# EasyEDA Pro project ProPrj.epro

# Schematic 模拟检测系统_2
Assembly Variant: Basic; Board Name: Board1; Create Date: 2026-07-22; Page Name: P1; Project Name: 院赛; Schematic Name: Schematic1; Update Date: 2026-07-22; Company: 嘉立创EDA; Page Size: A4; Version: V1.0
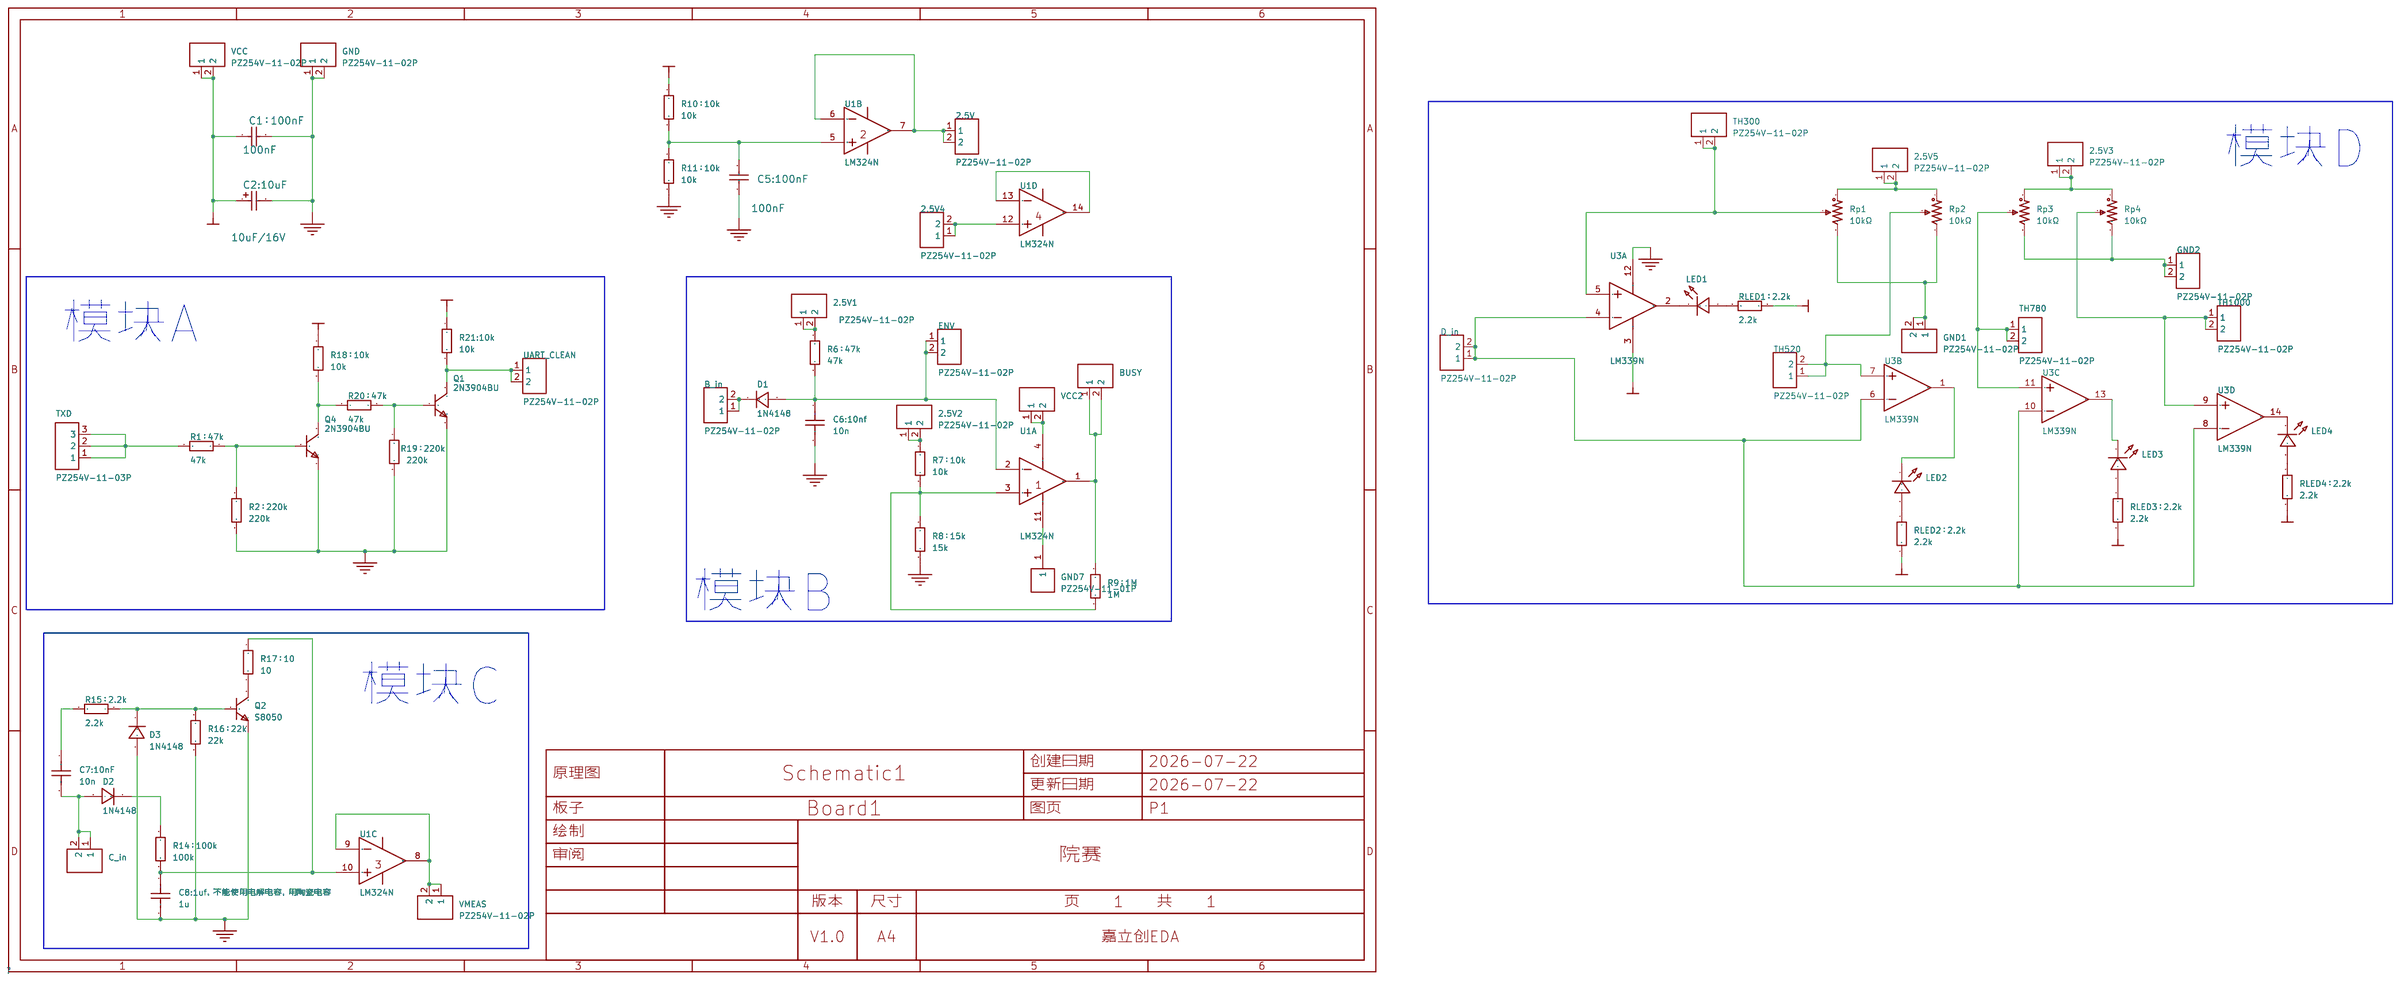
[diagram p0: schematic sheet]

## Parts
2.5V  PZ254V-11-02P  [HDR-TH_2P-P2.54-V-M]
2.5V1  PZ254V-11-02P  [HDR-TH_2P-P2.54-V-M]
2.5V2  PZ254V-11-02P  [HDR-TH_2P-P2.54-V-M]
2.5V3  PZ254V-11-02P  [HDR-TH_2P-P2.54-V-M]
2.5V4  PZ254V-11-02P  [HDR-TH_2P-P2.54-V-M]
2.5V5  PZ254V-11-02P  [HDR-TH_2P-P2.54-V-M]
B_in  PZ254V-11-02P  [HDR-TH_2P-P2.54-V-M]
BUSY  PZ254V-11-02P  [HDR-TH_2P-P2.54-V-M]
C1：100nF  100nF  [CAP-TH_L8.5-W5.0-P5.00-D1.2]
C2:10uF  10uF/16V  [CAP-TH_L8.5-W5.0-P5.00-D1.2]
C5:100nF  100nF  [CAP-TH_L8.5-W5.0-P5.00-D1.2]
C6:10nf  10n  [CAP-TH_L8.5-W5.0-P5.00-D1.2]
C7:10nF  10n  [CAP-TH_L8.5-W5.0-P5.00-D1.2]
C8:1uf，不能使用电解电容，用陶瓷电容  1u  [CAP-TH_L8.5-W5.0-P5.00-D1.2]
C_in  PZ254V-11-02P  [HDR-TH_2P-P2.54-V-M]
D1  1N4148  [DO-35_BD2.0-L4.2-P8.20-D0.5-RD]
D2  1N4148  [DO-35_BD2.0-L4.2-P8.20-D0.5-RD]
D3  1N4148  [DO-35_BD2.0-L4.2-P8.20-D0.5-RD]
D_in  PZ254V-11-02P  [HDR-TH_2P-P2.54-V-M]
ENV  PZ254V-11-02P  [HDR-TH_2P-P2.54-V-M]
GND  PZ254V-11-02P  [HDR-TH_2P-P2.54-V-M]
GND1  PZ254V-11-02P  [HDR-TH_2P-P2.54-V-M]
GND2  PZ254V-11-02P  [HDR-TH_2P-P2.54-V-M]
GND7  PZ254V-11-01P  [HDR-TH_1P-P2.54-V-M]
LED1  WP1533BQ/ID  [LED-TH_BD5.8-P2.54-FD_BIUE]
LED2  WP1533BQ/ID  [LED-TH_BD5.8-P2.54-FD_BIUE]
LED3  WP1533BQ/ID  [LED-TH_BD5.8-P2.54-FD_BIUE]
LED4  WP1533BQ/ID  [LED-TH_BD5.8-P2.54-FD_BIUE]
Q1  2N3904BU  [TO-92-3_L5.1-W4.1-P1.27-L]
Q2  S8050  [TO-92-3_L5.1-W4.1-P1.27-L]
Q4  2N3904BU  [TO-92-3_L5.1-W4.1-P1.27-L]
R1：47k  47k  [R_AXIAL-0.3]
R2：220k  220k  [R_AXIAL-0.3]
R6：47k  47k  [R_AXIAL-0.3]
R7：10k  10k  [R_AXIAL-0.3]
R8：15k  15k  [R_AXIAL-0.3]
R9：1M  1M  [R_AXIAL-0.3]
R10：10k  10k  [R_AXIAL-0.3]
R11：10k  10k  [R_AXIAL-0.3]
R14：100k  100k  [R_AXIAL-0.3]
R15：2.2k  2.2k  [R_AXIAL-0.3]
R16：22k  22k  [R_AXIAL-0.3]
R17：10  10  [R_AXIAL-0.3]
R18：10k  10k  [R_AXIAL-0.3]
R19：220k  220k  [R_AXIAL-0.3]
R20：47k  47k  [R_AXIAL-0.3]
R21:10k  10k  [R_AXIAL-0.3]
RLED1：2.2k  2.2k  [R_AXIAL-0.3]
RLED2：2.2k  2.2k  [R_AXIAL-0.3]
RLED3：2.2k  2.2k  [R_AXIAL-0.3]
RLED4：2.2k  2.2k  [R_AXIAL-0.3]
Rp1  10kΩ  [RES-ADJ-TH_3296W-1-104_C48601076]
Rp2  10kΩ  [RES-ADJ-TH_3296W-1-104_C48601076]
Rp3  10kΩ  [RES-ADJ-TH_3296W-1-104_C48601076]
Rp4  10kΩ  [RES-ADJ-TH_3296W-1-104_C48601076]
TH300  PZ254V-11-02P  [HDR-TH_2P-P2.54-V-M]
TH520  PZ254V-11-02P  [HDR-TH_2P-P2.54-V-M]
TH780  PZ254V-11-02P  [HDR-TH_2P-P2.54-V-M]
TH1000  PZ254V-11-02P  [HDR-TH_2P-P2.54-V-M]
TXD  PZ254V-11-03P  [HDR-TH_3P-P2.54-V-M_PZ254V-11-03P]
U1  LM324N  [DIP-14_L19.4-W6.4-P2.54-LS7.6-BL]  (sections 1,2,3,4)
U3  LM339N  [PDIP-14_L19.3-W6.4-P2.54-LS9.0-BL]  (sections 1,2,3,4)
UART_CLEAN  PZ254V-11-02P  [HDR-TH_2P-P2.54-V-M]
VCC  PZ254V-11-02P  [HDR-TH_2P-P2.54-V-M]
VCC2  PZ254V-11-02P  [HDR-TH_2P-P2.54-V-M]
VMEAS  PZ254V-11-02P  [HDR-TH_2P-P2.54-V-M]

## Library data of the parts
2.5V 2.5V1-2.5V5 B_in BUSY C_in D_in ENV GND GND1 GND2 TH300 TH520 TH780 TH1000 UART_CLEAN VCC VCC2 VMEAS = PZ254V-11-02P: 插针结构:1x2P;间距:2.54mm;行距:-;圆针/方针:方针;安装方式:直插;排数:单排;总PIN位数:2P;额定电流:3A;额定电压:250V;配合针长度:6mm;塑高:2.5mm;端接针长度:3mm;触头材质:黄铜;触头镀层:-;工作温度:-40℃~+105℃;颜色:黑色;; LCSC Part Name: 1x2P 间距:2.54mm 方针 直插; Supplier Part: C492401; Manufacturer: XFCN(兴飞); Supplier Footprint: 插件,P=2.54mm; JLCPCB Part Class: Extended Part; Datasheet: https://item.szlcsc.com/datasheet/PZ254V-11-02P/502957.html; Supplier: LCSC; Pin Structure: 1x2P; Pitch: 2.54mm; Circluar Pins/Square Pins: 方针; Mounting Type: 直插; Number of Rows: 单排; Number of Pins: 2P; Current Rating: 3A; Voltage Rating (Max): 250V; Length of Mating Pin: 6mm; Insulation Height: 2.5mm; Length of End Connection Pin: 3mm; Contact Material: 黄铜; Operating Temperature: -40℃~+105℃; Color: 黑色
C1：100nF C5:100nF = Cap_1: Capacitor; Published: 8-Jun-2000; LatestRevisionDate: 17-Jul-2002; LatestRevisionNote: Re-released for DXP Platform.; Publisher: Altium Limited; DesignItemID: Cap; LibraryName: *
C2:10uF = Cap Pol1: Polarized Capacitor (Radial); Published: 8-Jun-2000; LatestRevisionDate: 17-Jul-2002; LatestRevisionNote: Re-released for DXP Platform.; Publisher: Altium Limited; LibraryName: Miscellaneous Devices
C6:10nf C7:10nF C8:1uf，不能使用电解电容，用陶瓷电容 = CT4-0805B104K500F3: 容值:100nF;精度:±10%;额定电压:50V;温度系数:X7R;; LCSC Part Name: 100nF ±10% 50V C3型（直脚）; Supplier Part: C84772; Manufacturer: FH(风华); Supplier Footprint: 插件,P=5.08mm; JLCPCB Part Class: 扩展库; Datasheet: https://atta.szlcsc.com/upload/public/pdf/source/20190402/C385200_059806A6312B28FF1421A2413EB641E1.pdf; Supplier: LCSC; Tolerance: ±10%; Voltage Rated: 50V; Temperature Coefficient: X7R
D1-D3 = 1N4148_C402212: 二极管配置:-;正向压降(Vf):1V@10mA;直流反向耐压(Vr):75V;整流电流:150mA;反向恢复时间(Trr):4ns;; LCSC Part Name: 75V 150mA; Supplier Part: C402212; Manufacturer: LGE(鲁光); Supplier Footprint: DO-35; JLCPCB Part Class: Extended Part; Datasheet: https://item.szlcsc.com/datasheet/1N4148/387357.html; Supplier: LCSC; Voltage - Forward(Vf@If): 1V@10mA; Voltage - DC Reverse(Vr): 75V; Current - Rectified: 150mA; Pd - Power Dissipation: 500mW; Reverse Leakage Current (Ir): 5uA@75V; Reverse Recovery Time (trr): 4ns; Non-Repetitive Peak Forward Surge Current: 2A
GND7 = PZ254V-11-01P: 插针结构:1x1P;间距:2.54mm;行距:-;圆针/方针:方针;安装方式:直插;排数:单排;总PIN位数:1P;额定电流:3A;额定电压:250V;配合针长度:6mm;塑高:2.5mm;端接针长度:3mm;触头材质:黄铜;触头镀层:-;工作温度:-40℃~+105℃;颜色:黑色;; LCSC Part Name: 1x1P 间距:2.54mm 方针 直插; Supplier Part: C492400; Manufacturer: XFCN(兴飞); Supplier Footprint: 插件,P=2.54mm; JLCPCB Part Class: Extended Part; Datasheet: https://item.szlcsc.com/datasheet/PZ254V-11-01P/502956.html; Supplier: LCSC; Pin Structure: 1x1P; Pitch: 2.54mm; Circluar Pins/Square Pins: 方针; Mounting Type: 直插; Number of Rows: 单排; Number of Pins: 1P; Current Rating: 3A; Voltage Rating (Max): 250V; Length of Mating Pin: 6mm; Insulation Height: 2.5mm; Length of End Connection Pin: 3mm; Contact Material: 黄铜; Operating Temperature: -40℃~+105℃; Color: 黑色
LED1-LED4 = WP1533BQ/ID: Supplier Part: C5213793; Manufacturer: Kingbright; Supplier Footprint: LED-TH; JLCPCB Part Class: Extended Part; Datasheet: https://item.szlcsc.com/datasheet/WP1533BQ%252FID/5909275.html; Supplier: LCSC
Q1 Q4 = 2N3904BU: 晶体管类型:NPN;集电极电流(Ic):200mA;集射极击穿电压(Vceo):40V;耗散功率(Pd):625mW;直流电流增益(hFE):100@10mA,1V;; LCSC Part Name: NPN 电流:200mA 电压:40V; Supplier Part: C124482; Manufacturer: onsemi(安森美); Supplier Footprint: TO-92; JLCPCB Part Class: Extended Part; Datasheet: https://item.szlcsc.com/datasheet/2N3904BU/125757.html; Supplier: LCSC; type: NPN; Current - Collector(Ic): 200mA; Collector - Emitter Voltage VCEO: 40V; Pd - Power Dissipation: 625mW; DC Current Gain: 100@10mA,1V; Transition frequency(fT): 300MHz; Current - Collector Cutoff: 50nA; Vce Saturation(VCE(sat)): 200mV; Operating Temperature: -55℃~+150℃; Emitter-Base Voltage(Vebo): 6V; Number: 1个NPN
Q2 = S8050_C20069125: 晶体管类型:NPN;集电极电流(Ic):500mA;集射极击穿电压(Vceo):25V;耗散功率(Pd):300mW;直流电流增益(hFE):120@50mA,1.0V;; LCSC Part Name: hFE:200-350，丝印:J3Y NPN 500mA 25V; Supplier Part: C20069125; Manufacturer: R+O(宏嘉诚); Supplier Footprint: SOT-23; JLCPCB Part Class: Extended Part; Datasheet: https://item.szlcsc.com/datasheet/S8050/21397163.html; Supplier: LCSC; type: NPN; Current - Collector(Ic): 500mA; Collector - Emitter Voltage VCEO: 25V; Pd - Power Dissipation: 300mW; DC Current Gain: 120@50mA,1.0V; Transition frequency(fT): 100MHz; Current - Collector Cutoff: 100nA; Vce Saturation(VCE(sat)): 600mV@500mA,50mA; Operating Temperature: -55℃~+150℃; Emitter-Base Voltage(Vebo): 5V
R1：47k R2：220k R6：47k R7：10k R8：15k R9：1M R10：10k R11：10k R14：100k R15：2.2k R16：22k R17：10 R18：10k R19：220k R20：47k R21:10k RLED1：2.2k RLED2：2.2k RLED3：2.2k RLED4：2.2k = Res_0603: Supplier Footprint: 0603
Rp1-Rp4 = 3296W-1-103: 阻值:10kΩ;精度:±10%;; LCSC Part Name: 10kΩ ±10%; Supplier Part: C118954; Manufacturer: BOCHEN(博晨); Supplier Footprint: 插件; JLCPCB Part Class: 扩展库; Datasheet: https://atta.szlcsc.com/upload/public/pdf/source/20171114/C118954_15106326646611117443.pdf; Supplier: LCSC; Tolerance: ±10%
TXD = PZ254V-11-03P: 插针结构:1x3P;间距:2.54mm;行距:-;圆针/方针:方针;安装方式:直插;排数:单排;总PIN位数:3P;额定电流:3A;额定电压:250V;配合针长度:6mm;塑高:2.5mm;端接针长度:3mm;工作温度:-40℃~+105℃;颜色:黑色;; LCSC Part Name: 1x3P 间距:2.54mm 方针 直插; Supplier Part: C2937625; Manufacturer: XFCN(兴飞); Supplier Footprint: 插件,P=2.54mm; JLCPCB Part Class: Extended Part; Datasheet: https://item.szlcsc.com/datasheet/PZ254V-11-03P/3293280.html; Supplier: LCSC; Pin Structure: 1x3P; Pitch: 2.54mm; Circluar Pins/Square Pins: 方针; Mounting Type: 直插; Number of Rows: 单排; Number of Pins: 3P; Current Rating: 3A; Voltage Rating (Max): 250V; Length of Mating Pin: 6mm; Insulation Height: 2.5mm; Length of End Connection Pin: 3mm; Operating Temperature: -40℃~+105℃; Color: 黑色
U1 = LM324N_C725320: 放大器数:4;轨到轨:-;增益带宽积(GBW):-;输入失调电压(Vos):9mV;压摆率(SR):-;输入偏置电流(Ib):250nA;; LCSC Part Name: 四路运算放大器; Supplier Part: C725320; Manufacturer: HGSEMI(华冠); Supplier Footprint: DIP-14; JLCPCB Part Class: Extended Part; Datasheet: https://item.szlcsc.com/datasheet/LM324N/771554.html; Supplier: LCSC; Number of Channels: 4; Maximum Power Supply Range (Vdd-Vss): 30V; Vos - Input Offset Voltage: 9mV; Input Offset Voltage Drift(Vos TC): 7uV/℃; Ib - Input Bias Current: 250nA; Input Offset Current(Ios): 50nA; Common Mode Rejection Ratio(CMRR): 80dB; Quiescent Current: 600uA; Output Current: 35mA; Operating Temperature: -40℃~+85℃; Single supply: 1.5V~30V; Dual Supply: -16V~-1.5V；1.5V~16V
U3 = LM339N_C39202084: 输入失调电压(Vos):5mV;输入偏置电流(Ib):25nA;; LCSC Part Name: 四差分比较器; Supplier Part: C39202084; Manufacturer: TI(德州仪器); Supplier Footprint: DIP-14; JLCPCB Part Class: Extended Part; Datasheet: https://www.ti.com/lit/gpn/lm339; Supplier: LCSC; Vos - Input Offset Voltage: 5mV; Ib - Input Bias Current: 25nA; Propagation Delay Time: 300ns; Quiescent Current: 2mA; Operating Temperature: -40℃~+85℃

## Nets
GND: C1：100nF.2 C2:10uF.2 C5:100nF.1 C6:10nf.2 C8:1uf，不能使用电解电容，用陶瓷电容.2 D3.2(A) GND.1 GND.2 Q1.1(E) Q2.2(E) Q4.1(E) R2：220k.2 R8：15k.2 R11：10k.2 R16：22k.2 R19：220k.2 U3.12(GND)
VCC: C1：100nF.1 C2:10uF.1 R10：10k.1 R18：10k.1 R21:10k.1 RLED1：2.2k.1 RLED2：2.2k.2 RLED3：2.2k.2 RLED4：2.2k.2 U3.3(V+) VCC.1 VCC.2
$1N7: R1：47k.2 TXD.1 TXD.2 TXD.3
$1N8: Q4.2(B) R1：47k.1 R2：220k.1
$1N40: C6:10nf.1 D1.2(A) ENV.1 ENV.2 R6：47k.2 U1.2(IN1-)
$1N42: GND7.1 U1.11(GND)
$1N48: C5:100nF.2 R10：10k.2 R11：10k.1 U1.5(IN2+)
$1N53: R7：10k.2 R8：15k.1 R9：1M.1 U1.3(IN1+)
$1N55: 2.5V.1 2.5V.2 U1.6(IN2-) U1.7(OUT2)
$1N76: C8:1uf，不能使用电解电容，用陶瓷电容.1 R14：100k.2 R17：10.1 U1.10(IN3+)
$1N77: C7:10nF.1 R15：2.2k.2
$1N78: D3.1(C) Q2.1(B) R15：2.2k.1 R16：22k.1
$1N81: Q2.3(C) R17：10.2
$1N84: D2.1(C) R14：100k.1
$1N96: Rp1.2 TH300.1 TH300.2 U3.5(IN+)
$1N111: LED2.2(A) RLED2：2.2k.1
$1N113: LED3.2(A) RLED3：2.2k.1
$1N116: Rp4.2 TH1000.1 TH1000.2 U3.9(IN+)
$1N118: GND1.1 GND1.2 Rp1.3 Rp2.3
$1N121: GND2.1 GND2.2 Rp3.3 Rp4.3
$1N124: LED4.2(A) RLED4：2.2k.1
$1N134: B_in.1 B_in.2 D1.1(C)
$1N135: C7:10nF.2 C_in.1 C_in.2 D2.2(A)
$1N136: BUSY.1 BUSY.2 R9：1M.2 U1.1(OUT1)
$1N139: U1.8(OUT3) U1.9(IN3-) VMEAS.1 VMEAS.2
$1N145: 2.5V1.1 2.5V1.2 R6：47k.1
$1N147: 2.5V2.1 2.5V2.2 R7：10k.1
$1N149: Q4.3(C) R18：10k.2 R20：47k.1
$1N151: Q1.2(B) R19：220k.1 R20：47k.2
$1N153: Q1.3(C) R21:10k.2 UART_CLEAN.1 UART_CLEAN.2
$1N160: D_in.1 D_in.2 U3.4(IN-) U3.6(IN-) U3.8(IN-) U3.10(IN-)
$1N162: LED1.2(A) RLED1：2.2k.2
$1N163: LED1.1(C) U3.2(OUT)
$1N169: Rp3.2 TH780.1 TH780.2 U3.11(IN+)
$1N170: Rp2.2 TH520.1 TH520.2 U3.7(IN+)
$1N175: LED2.1(C) U3.1(OUT)
$1N176: LED3.1(C) U3.13(OUT)
$1N177: LED4.1(C) U3.14(OUT)
$1N180: 2.5V4.1 2.5V4.2 U1.12(IN4+)
$1N181: U1.13(IN4-) U1.14(OUT4)
$1N183: 2.5V3.1 2.5V3.2 Rp3.1 Rp4.1
$1N184: 2.5V5.1 2.5V5.2 Rp1.1 Rp2.1
$1N190: U1.4(VCC) VCC2.1 VCC2.2

## Notes on the sheet
- 模块D
- 模块A
- 模块B
- 模块C

# Board PCB2_1
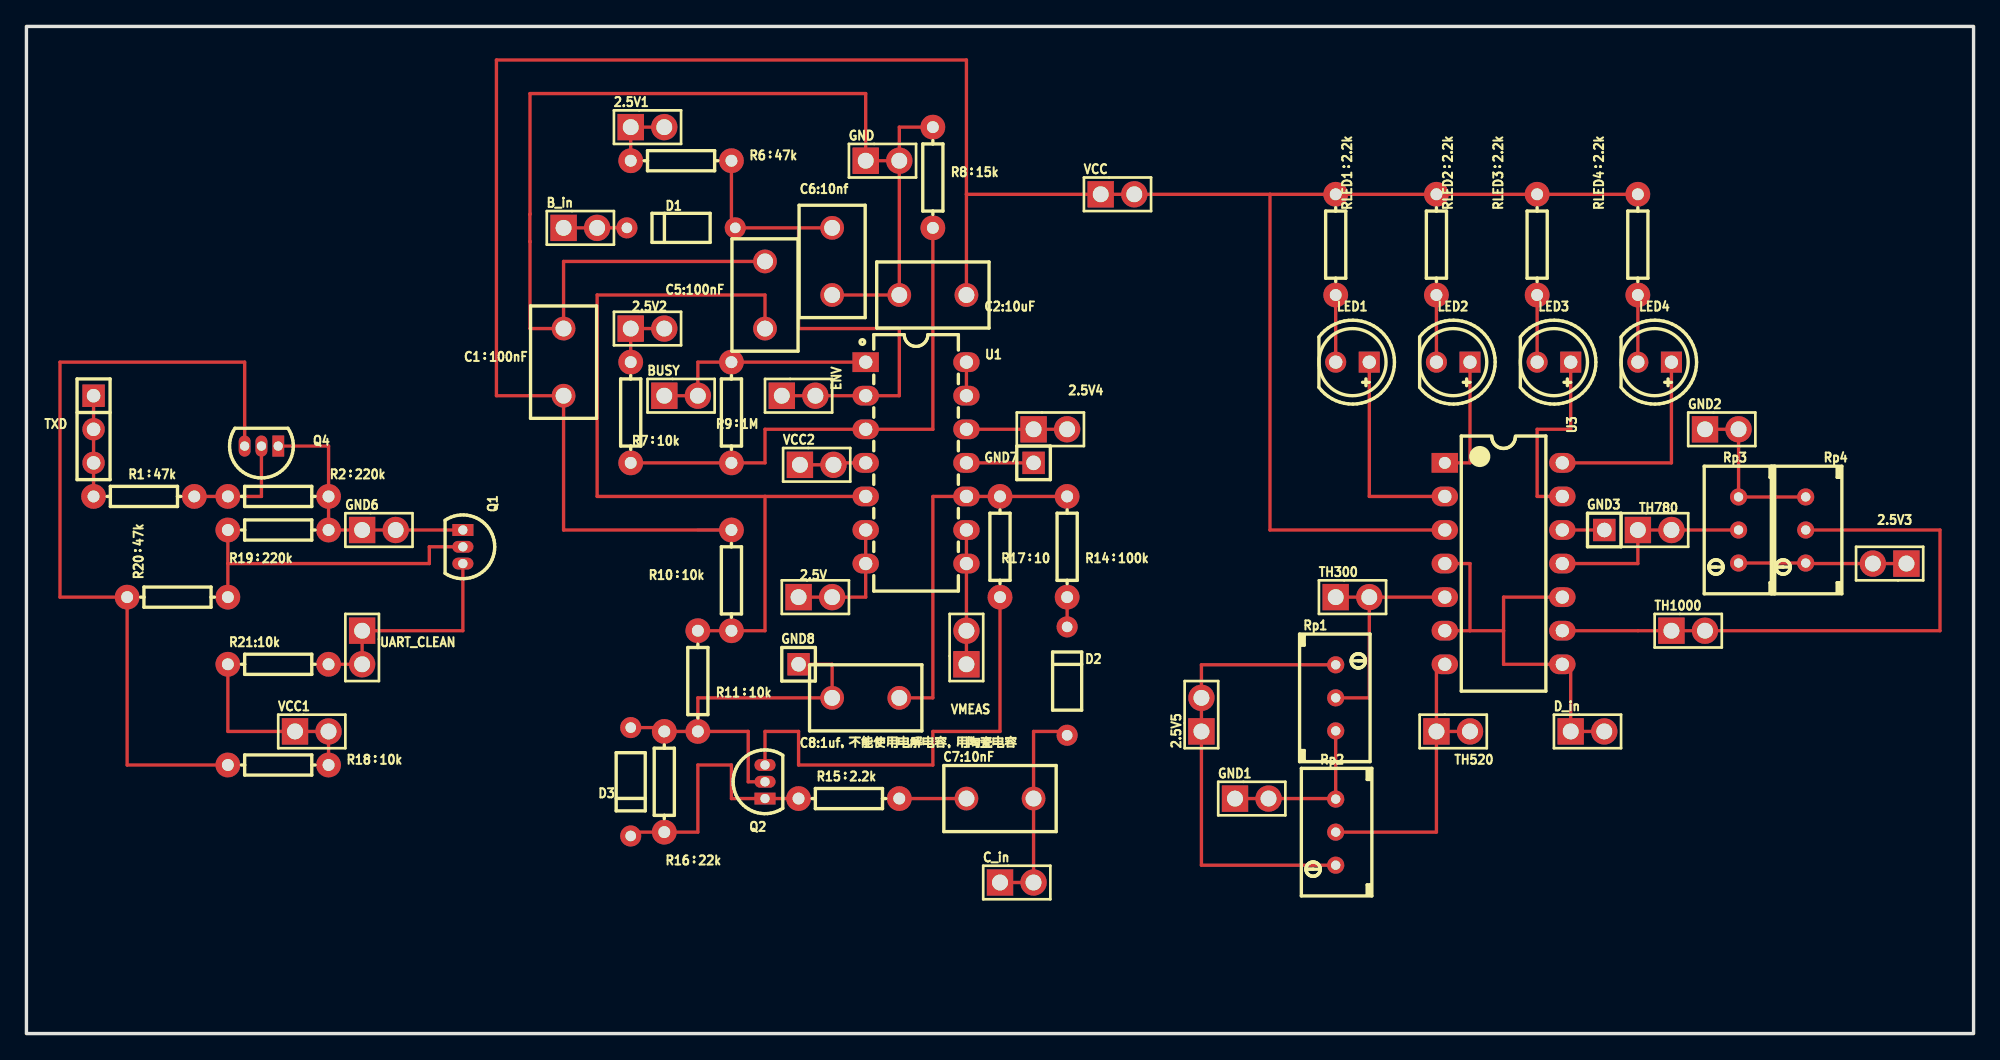
[diagram p1: board, top side]
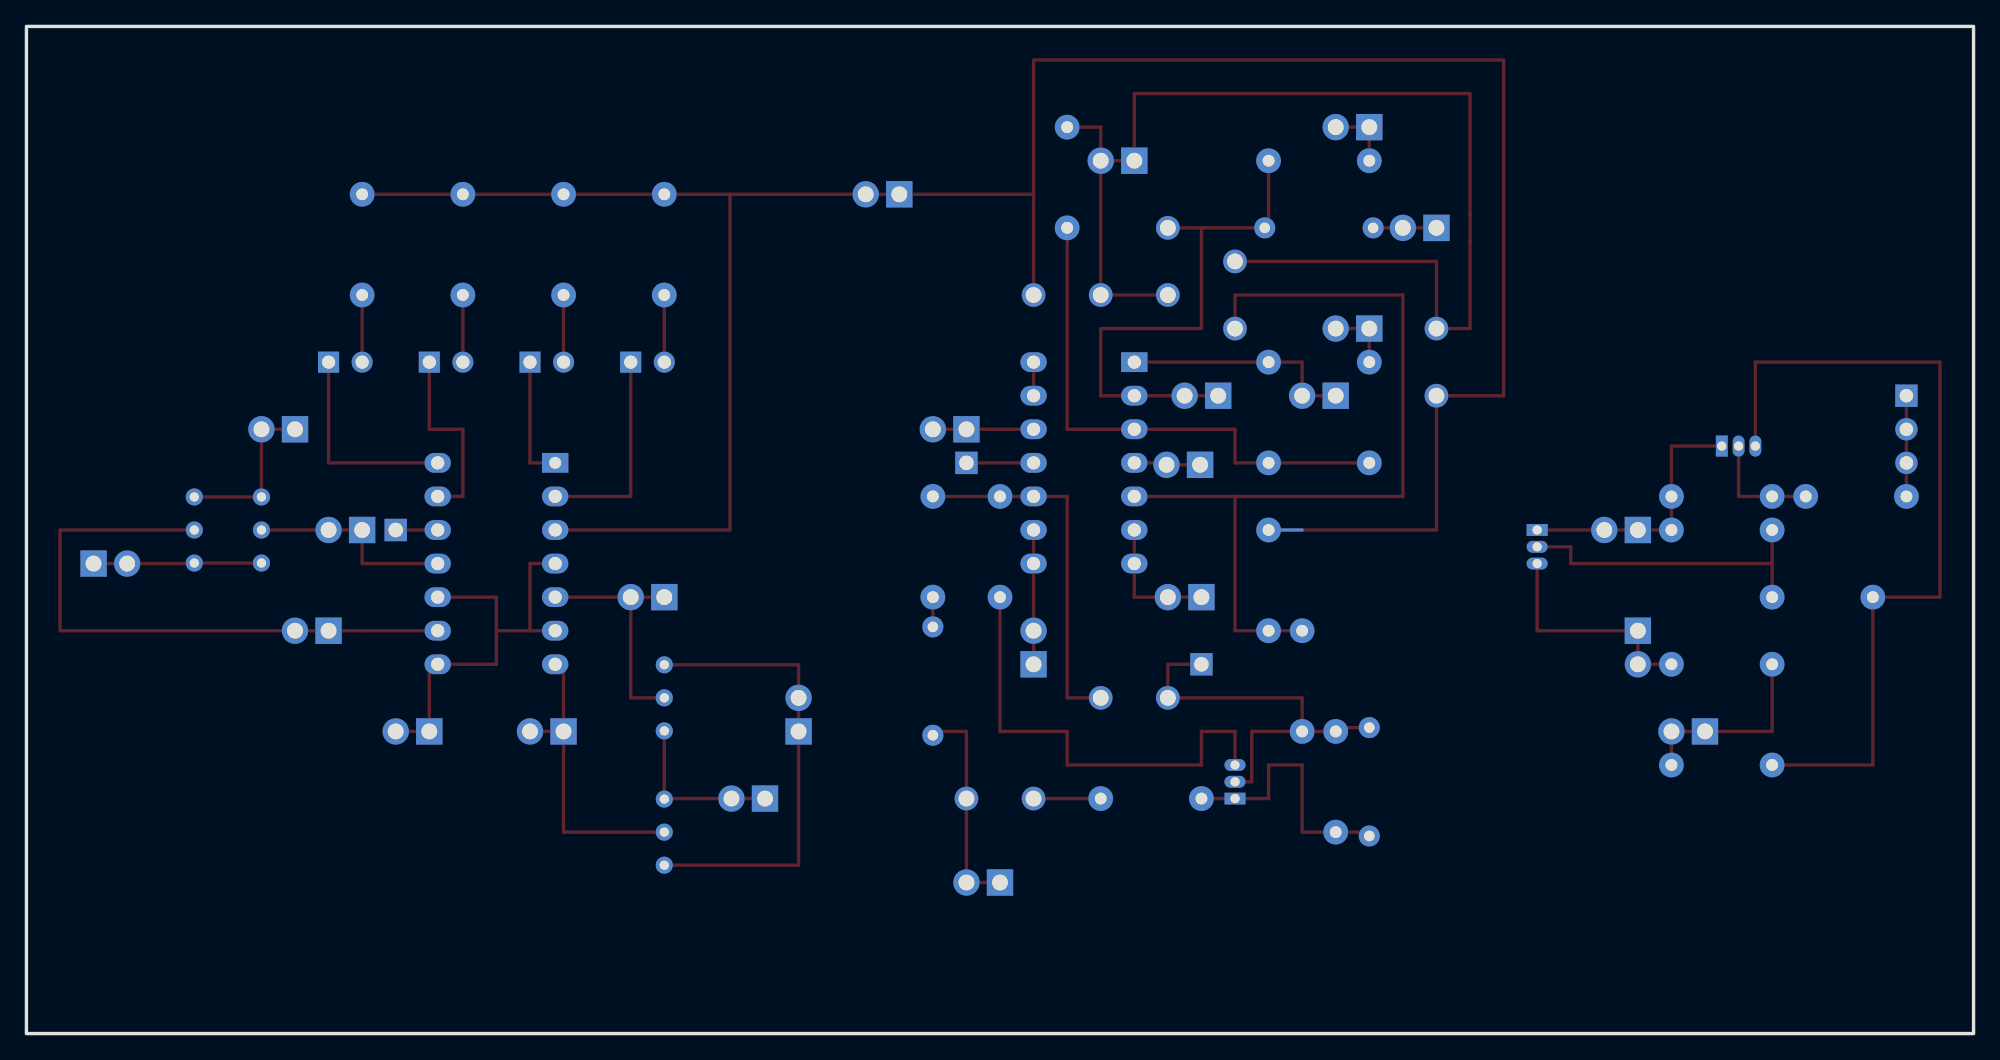
[diagram p2: board, bottom side, seen from below]

Outline 147.32 x 76.2 mm; copper layers: Top Layer, Bottom Layer. Coordinates in mm from the lower left corner of the outline.
Outline path: rectangle 0,76.2 147.32,0
Stack: Top Layer 0.035mm / Dielectric1 1.51mm FR4 er 4.5 / Bottom Layer 0.035mm

## Design rules (mm)
spacing copperThickness1oz (default): track to track 0.102, other pairs 0.152 to 0.3
spacing copperThickness2oz: track to track 0.203, other pairs 0.152 to 0.3
track width copperThickness1oz (default): min 0.127, default 0.254, max 2.54
track width copperThickness2oz: min 0.203, default 0.254, max 2.54
differential pair differentialPair (default): width min 0.127, default 0.254, max 2.54; gap min 0.152, default 0.152

## Placement (name value [footprint] x y rotation side)
2.5V  PZ254V-11-02P  [HDR-TH_2P-P2.54-V-M]  59.69 33.02 0 top
2.5V1  PZ254V-11-02P  [HDR-TH_2P-P2.54-V-M]  46.99 68.58 0 top
2.5V2  PZ254V-11-02P  [HDR-TH_2P-P2.54-V-M]  46.99 53.34 0 top
2.5V3  PZ254V-11-02P  [HDR-TH_2P-P2.54-V-M]  140.97 35.56 180 top
2.5V4  PZ254V-11-02P  [HDR-TH_2P-P2.54-V-M]  77.47 45.72 0 top
2.5V5  PZ254V-11-02P  [HDR-TH_2P-P2.54-V-M]  88.9 24.13 90 top
B_in  PZ254V-11-02P  [HDR-TH_2P-P2.54-V-M]  41.91 60.96 0 top
BUSY  PZ254V-11-02P  [HDR-TH_2P-P2.54-V-M]  49.53 48.26 0 top
C1：100nF  100nF  [CAP-TH_L8.5-W5.0-P5.00-D1.2]  40.64 50.8 90 top
C2:10uF  10uF/16V  [CAP-TH_L8.5-W5.0-P5.00-D1.2]  68.58 55.88 180 top
C5:100nF  100nF  [CAP-TH_L8.5-W5.0-P5.00-D1.2]  55.88 55.88 270 top
C6:10nf  10n  [CAP-TH_L8.5-W5.0-P5.00-D1.2]  60.96 58.42 270 top
C7:10nF  10n  [CAP-TH_L8.5-W5.0-P5.00-D1.2]  73.66 17.78 0 top
C8:1uf，不能使用电解电容，用陶瓷电容  1u  [CAP-TH_L8.5-W5.0-P5.00-D1.2]  63.5 25.4 180 top
C_in  PZ254V-11-02P  [HDR-TH_2P-P2.54-V-M]  74.93 11.43 0 top
D1  1N4148  [DO-35_BD2.0-L4.2-P8.20-D0.5-RD]  49.53 60.96 0 top
D2  1N4148  [DO-35_BD2.0-L4.2-P8.20-D0.5-RD]  78.74 26.67 270 top
D3  1N4148  [DO-35_BD2.0-L4.2-P8.20-D0.5-RD]  45.72 19.05 90 top
D_in  PZ254V-11-02P  [HDR-TH_2P-P2.54-V-M]  118.11 22.86 0 top
ENV  PZ254V-11-02P  [HDR-TH_2P-P2.54-V-M]  58.42 48.26 0 top
GND  PZ254V-11-02P  [HDR-TH_2P-P2.54-V-M]  64.77 66.04 0 top
GND1  PZ254V-11-02P  [HDR-TH_2P-P2.54-V-M]  92.71 17.78 0 top
GND2  PZ254V-11-02P  [HDR-TH_2P-P2.54-V-M]  128.27 45.72 0 top
GND3  PZ254V-11-01P  [HDR-TH_1P-P2.54-V-M]  119.38 38.1 0 top
GND6  PZ254V-11-02P  [HDR-TH_2P-P2.54-V-M]  26.67 38.1 0 top
GND7  PZ254V-11-01P  [HDR-TH_1P-P2.54-V-M]  76.2 43.18 0 top
GND8  PZ254V-11-01P  [HDR-TH_1P-P2.54-V-M]  58.42 27.94 0 top
LED1  WP1533BQ/ID  [LED-TH_BD5.8-P2.54-FD_BIUE]  100.33 50.8 180 top
LED2  WP1533BQ/ID  [LED-TH_BD5.8-P2.54-FD_BIUE]  107.95 50.8 180 top
LED3  WP1533BQ/ID  [LED-TH_BD5.8-P2.54-FD_BIUE]  115.57 50.8 180 top
LED4  WP1533BQ/ID  [LED-TH_BD5.8-P2.54-FD_BIUE]  123.19 50.8 180 top
Q1  2N3904BU  [TO-92-3_L5.1-W4.1-P1.27-L]  33.02 36.83 270 top
Q2  S8050  [TO-92-3_L5.1-W4.1-P1.27-L]  55.88 19.05 90 top
Q4  2N3904BU  [TO-92-3_L5.1-W4.1-P1.27-L]  17.78 44.45 180 top
R1：47k  47k  [R_AXIAL-0.3]  8.89 40.64 180 top
R2：220k  220k  [R_AXIAL-0.3]  19.05 40.64 0 top
R6：47k  47k  [R_AXIAL-0.3]  49.53 66.04 0 top
R7：10k  10k  [R_AXIAL-0.3]  45.72 46.99 270 top
R8：15k  15k  [R_AXIAL-0.3]  68.58 64.77 90 top
R9：1M  1M  [R_AXIAL-0.3]  53.34 46.99 90 top
R10：10k  10k  [R_AXIAL-0.3]  53.34 34.29 270 top
R11：10k  10k  [R_AXIAL-0.3]  50.8 26.67 270 top
R14：100k  100k  [R_AXIAL-0.3]  78.74 36.83 90 top
R15：2.2k  2.2k  [R_AXIAL-0.3]  62.23 17.78 0 top
R16：22k  22k  [R_AXIAL-0.3]  48.26 19.05 90 top
R17：10  10  [R_AXIAL-0.3]  73.66 36.83 270 top
R18：10k  10k  [R_AXIAL-0.3]  19.05 20.32 180 top
R19：220k  220k  [R_AXIAL-0.3]  19.05 38.1 0 top
R20：47k  47k  [R_AXIAL-0.3]  11.43 33.02 0 top
R21:10k  10k  [R_AXIAL-0.3]  19.05 27.94 0 top
RLED1：2.2k  2.2k  [R_AXIAL-0.3]  99.06 59.69 270 top
RLED2：2.2k  2.2k  [R_AXIAL-0.3]  106.68 59.69 90 top
RLED3：2.2k  2.2k  [R_AXIAL-0.3]  114.3 59.69 90 top
RLED4：2.2k  2.2k  [R_AXIAL-0.3]  121.92 59.69 90 top
Rp1  10kΩ  [RES-ADJ-TH_3296W-1-104_C48601076]  99.06 25.4 0 top
Rp2  10kΩ  [RES-ADJ-TH_3296W-1-104_C48601076]  99.06 15.24 180 top
Rp3  10kΩ  [RES-ADJ-TH_3296W-1-104_C48601076]  129.54 38.1 180 top
Rp4  10kΩ  [RES-ADJ-TH_3296W-1-104_C48601076]  134.62 38.1 180 top
TH300  PZ254V-11-02P  [HDR-TH_2P-P2.54-V-M]  100.33 33.02 0 top
TH520  PZ254V-11-02P  [HDR-TH_2P-P2.54-V-M]  107.95 22.86 0 top
TH780  PZ254V-11-02P  [HDR-TH_2P-P2.54-V-M]  123.19 38.1 0 top
TH1000  PZ254V-11-02P  [HDR-TH_2P-P2.54-V-M]  125.73 30.48 0 top
TXD  PZ254V-11-03P  [HDR-TH_3P-P2.54-V-M_PZ254V-11-03P]  5.08 45.72 270 top
U1  LM324N  [DIP-14_L19.4-W6.4-P2.54-LS7.6-BL]  67.31 43.18 270 top
U3  LM339N  [PDIP-14_L19.3-W6.4-P2.54-LS9.0-BL]  111.76 35.56 270 top
UART_CLEAN  PZ254V-11-02P  [HDR-TH_2P-P2.54-V-M]  25.4 29.21 270 top
VCC  PZ254V-11-02P  [HDR-TH_2P-P2.54-V-M]  82.55 63.5 0 top
VCC1  PZ254V-11-02P  [HDR-TH_2P-P2.54-V-M]  21.59 22.86 0 top
VCC2  PZ254V-11-02P  [HDR-TH_2P-P2.54-V-M]  59.79 43.03 0 top
VMEAS  PZ254V-11-02P  [HDR-TH_2P-P2.54-V-M]  71.12 29.21 90 top

## Footprints (pads in the part's own frame, mm; a bottom-side part is the same pattern mirrored in y, then rotated)
CAP-TH_L8.5-W5.0-P5.00-D1.2
  round 1.8 hole 1.2: 1(-2.54,0) 2(2.54,0)
DIP-14_L19.4-W6.4-P2.54-LS7.6-BL
  rect 1.5x2 hole 1: 1(-7.62,-3.811)
  oval 1.5x2 hole 1: 2(-5.08,-3.811) 3(-2.54,-3.811) 4(0,-3.811) 5(2.54,-3.811) 6(5.08,-3.811) 7(7.62,-3.811) 8(7.62,3.811) 9(5.08,3.809) 10(2.54,3.809) 11(0,3.809) 12(-2.54,3.809) 13(-5.08,3.809) 14(-7.62,3.809)
DO-35_BD2.0-L4.2-P8.20-D0.5-RD
  round 1.6 hole 0.8: 1(-4.1,0) 2(4.1,0)
HDR-TH_1P-P2.54-V-M
  rect 1.7x1.7 hole 1.1: 1(0,0)
HDR-TH_2P-P2.54-V-M
  rect 2x2 hole 1.2: 1(-1.27,0)
  round 2 hole 1.2: 2(1.27,0)
HDR-TH_3P-P2.54-V-M_PZ254V-11-03P
  rect 1.7x1.7 hole 1.02: 1(-2.54,0)
  round 1.7 hole 1.02: 2(0,0) 3(2.54,0)
LED-TH_BD5.8-P2.54-FD_BIUE
  rect 1.6x1.6 hole 1: 1(-1.27,0)
  round 1.6 hole 1: 2(1.27,0)
PDIP-14_L19.3-W6.4-P2.54-LS9.0-BL
  rect 1.5x2 hole 0.9: 1(-7.62,-4.445)
  oval 1.5x2 hole 1: 2(-5.08,-4.445) 3(-2.54,-4.445) 4(0,-4.445) 5(2.54,-4.445) 6(5.08,-4.445) 7(7.62,-4.445) 8(7.62,4.445) 9(5.08,4.445) 10(2.54,4.445) 11(0,4.445) 12(-2.54,4.445) 13(-5.08,4.445) 14(-7.62,4.445)
R_AXIAL-0.3
  round 1.879 hole 0.899: 1(-3.81,0) 2(3.81,0)
RES-ADJ-TH_3296W-1-104_C48601076
  round 1.3 hole 0.7: 1(0,2.5) 2(0,0) 3(0,-2.5)
TO-92-3_L5.1-W4.1-P1.27-L
  rect 0.9x1.6 hole 0.7: 1(-1.27,0)
  oval 0.9x1.6 hole 0.7: 2(0,0) 3(1.27,0)

## Nets
As in the schematic, except:
GND: C1：100nF.2 C2:10uF.2 C5:100nF.1 C6:10nf.2 GND.1 GND.2 R8：15k.2
VCC: C1：100nF.1 C2:10uF.1 R10：10k.1 RLED1：2.2k.1 RLED2：2.2k.2 RLED3：2.2k.2 RLED4：2.2k.2 U3.3 VCC.1 VCC.2
$1N9: GND6.1 GND6.2 Q1.1 Q4.1 R2：220k.2 R19：220k.2
$1N80: C8:1uf，不能使用电解电容，用陶瓷电容.2 D3.2 GND8.1 Q2.2 R11：10k.2 R16：22k.2
$1N154: R18：10k.1 R21:10k.1 VCC1.1 VCC1.2
$1N186: GND3.1 U3.12

## Routing (per net, layer and track width the routed paths; a pad name or vN(x,y) marks a point on that pad's centre or on a via; arc(x,y) is an arc through that point)
GND: length 94
  Top Layer w0.254: C6:10nf.2 C2:10uF.2 GND.2 ; GND.2 GND.1 63.5,71.12 38.1,71.12 38.1,62.03 arc(38.09,62) 38.09,61.96 38.09,59.96 arc(38.09,59.92) 38.1,59.89 38.1,53.34 C1：100nF.2 40.64,58.42 C5:100nF.1 ; GND.2 66.04,68.58 R8：15k.2
VCC: length 198.6
  Top Layer w0.254: R10：10k.1 40.64,38.1 C1：100nF.1 35.56,48.26 35.56,73.66 71.12,73.66 71.12,63.5 ; 94.09,63.5 RLED1：2.2k.1 RLED2：2.2k.2 RLED3：2.2k.2 RLED4：2.2k.2 ; 94.09,63.5 VCC.2 VCC.1 71.12,63.5 ; 94.09,63.5 94.09,38.1 U3.3 ; 71.12,63.5 C2:10uF.1
  Bottom Layer w0.254: 50.8,38.1 R10：10k.1
$1N7: length 7.6
  Top Layer w0.254: R1：47k.2 TXD.3 TXD.2 TXD.1
$1N8: length 8.9
  Top Layer w0.254: Q4.2 17.78,40.64 R2：220k.1 R1：47k.1
$1N9: length 20.3
  Top Layer w0.254: Q1.1 GND6.2 GND6.1 R19：220k.2 R2：220k.2 22.86,44.45 Q4.1
$1N40: length 41.9
  Top Layer w0.254: 58.42,60.96 C6:10nf.1 ; 58.42,60.96 58.42,53.34 66.04,53.34 66.04,48.26 U1.2 ENV.2 ENV.1 ; 58.42,60.96 D1.2 53.34,60.96 R6：47k.2
$1N42: length 5.1
  Top Layer w0.254: GND7.1 U1.11
$1N48: length 66
  Top Layer w0.254: 55.88,40.64 55.88,30.48 R10：10k.2 R11：10k.1 ; 55.88,40.64 U1.5 ; 55.88,40.64 43.18,40.64 43.18,55.88 55.88,55.88 C5:100nF.2
$1N53: length 40.6
  Top Layer w0.254: R7：10k.2 R9：1M.1 55.88,43.18 55.88,45.72 U1.3 68.58,45.72 R8：15k.1
$1N55: length 10.2
  Top Layer w0.254: U1.6 U1.7 63.5,33.02 2.5V.2 2.5V.1
$1N76: length 27.9
  Top Layer w0.254: R14：100k.2 R17：10.1 U1.10 68.58,40.64 68.58,25.4 C8:1uf，不能使用电解电容，用陶瓷电容.1
$1N77: length 5.1
  Top Layer w0.254: R15：2.2k.2 C7:10nF.1
$1N78: length 20.6
  Top Layer w0.254: R15：2.2k.1 Q2.1 53.34,17.78 53.34,20.32 50.8,20.32 50.8,15.24 R16：22k.1 45.72,15.24 D3.1
$1N80: length 32
  Top Layer w0.254: D3.2 48.26,23.15 R16：22k.2 R11：10k.2 ; GND8.1 60.96,27.94 C8:1uf，不能使用电解电容，用陶瓷电容.2 50.8,25.4 R11：10k.2 ; R11：10k.2 54.61,22.86 54.61,19.05 Q2.2
$1N81: length 35.6
  Top Layer w0.254: R17：10.2 73.66,22.86 68.58,22.86 68.58,20.32 58.42,20.32 58.42,22.86 55.88,22.86 Q2.3
$1N84: length 2.2
  Top Layer w0.254: D2.1 R14：100k.1
$1N96: length 18.4
  Top Layer w0.254: TH300.2 101.6,25.4 Rp1.2 ; TH300.2 TH300.1 ; TH300.2 U3.5
$1N111: length 5.1
  Top Layer w0.254: RLED2：2.2k.1 LED2.2
$1N113: length 5.1
  Top Layer w0.254: RLED3：2.2k.1 LED3.2
$1N116: length 46.4
  Top Layer w0.254: U3.9 TH1000.1 TH1000.2 144.78,30.48 144.78,38.1 Rp4.2
$1N118: length 12.8
  Top Layer w0.254: 99.06,17.78 Rp2.3 ; 99.06,17.78 GND1.2 GND1.1 ; 99.06,17.78 Rp1.3
$1N121: length 12.7
  Top Layer w0.254: Rp4.3 Rp3.3 GND2.2 GND2.1
$1N124: length 5.1
  Top Layer w0.254: RLED4：2.2k.1 LED4.2
$1N134: length 4.8
  Top Layer w0.254: B_in.1 B_in.2 D1.1
$1N135: length 16.8
  Top Layer w0.254: C_in.1 C_in.2 C7:10nF.2 76.2,22.86 78.74,22.86 D2.2
$1N136: length 17.8
  Top Layer w0.254: U1.1 R9：1M.2 50.8,50.8 BUSY.2 BUSY.1
$1N139: length 10.2
  Top Layer w0.254: U1.9 U1.8 VMEAS.2 VMEAS.1
$1N145: length 5.1
  Top Layer w0.254: 2.5V1.2 2.5V1.1 R6：47k.1
$1N147: length 5.1
  Top Layer w0.254: 2.5V2.2 2.5V2.1 R7：10k.1
$1N149: length 63.5
  Top Layer w0.254: R18：10k.2 7.62,20.32 R20：47k.1 2.54,33.02 2.54,50.8 16.51,50.8 Q4.3
$1N151: length 24.1
  Top Layer w0.254: R20：47k.2 15.24,35.56 ; 15.24,35.56 30.48,35.56 30.48,36.83 Q1.2 ; 15.24,35.56 R19：220k.1
$1N153: length 17.8
  Top Layer w0.254: R21:10k.2 UART_CLEAN.2 UART_CLEAN.1 33.02,30.48 Q1.3
$1N154: length 15.2
  Top Layer w0.254: R18：10k.1 VCC1.2 VCC1.1 15.24,22.86 R21:10k.1
$1N160: length 33.7
  Top Layer w0.254: 109.22,30.48 U3.6 ; 109.22,30.48 111.76,30.48 ; 109.22,30.48 109.22,35.56 U3.4 ; 111.76,30.48 111.76,33.02 U3.10 ; 111.76,30.48 111.76,27.94 U3.8 116.84,27.94 D_in.1 D_in.2
$1N162: length 5.1
  Top Layer w0.254: RLED1：2.2k.2 LED1.2
$1N163: length 15.9
  Top Layer w0.254: U3.2 101.6,40.64 LED1.1
$1N169: length 15.9
  Top Layer w0.254: Rp3.2 TH780.2 TH780.1 121.92,35.56 U3.11
$1N170: length 23.5
  Top Layer w0.254: TH520.1 TH520.2 ; TH520.1 106.68,15.24 Rp2.2 ; TH520.1 106.68,27.94 U3.7
$1N175: length 9.5
  Top Layer w0.254: U3.1 109.22,43.18 LED2.1
$1N176: length 14.6
  Top Layer w0.254: LED3.1 116.84,45.72 114.3,45.72 114.3,40.64 U3.13
$1N177: length 15.9
  Top Layer w0.254: U3.14 124.46,43.18 LED4.1
$1N180: length 7.6
  Top Layer w0.254: 2.5V4.2 2.5V4.1 U1.12
$1N181: length 2.5
  Top Layer w0.254: U1.13 U1.14
$1N183: length 12.7
  Top Layer w0.254: 2.5V3.1 2.5V3.2 134.62,35.56 Rp4.1 Rp3.1
$1N184: length 35.5
  Top Layer w0.254: Rp2.1 88.9,12.74 2.5V5.1 2.5V5.2 88.9,27.9 Rp1.1
$1N186: length 3.2
  Top Layer w0.254: GND3.1 U3.12
$1N190: length 5.1
  Top Layer w0.254: U1.4 61.06,43.18 VCC2.2 VCC2.1
